# Altium schematic sheet Encoder_Sheet4.SchDoc
size 420 x 297 mm; SheetNumber: 31; SheetTotal: 32
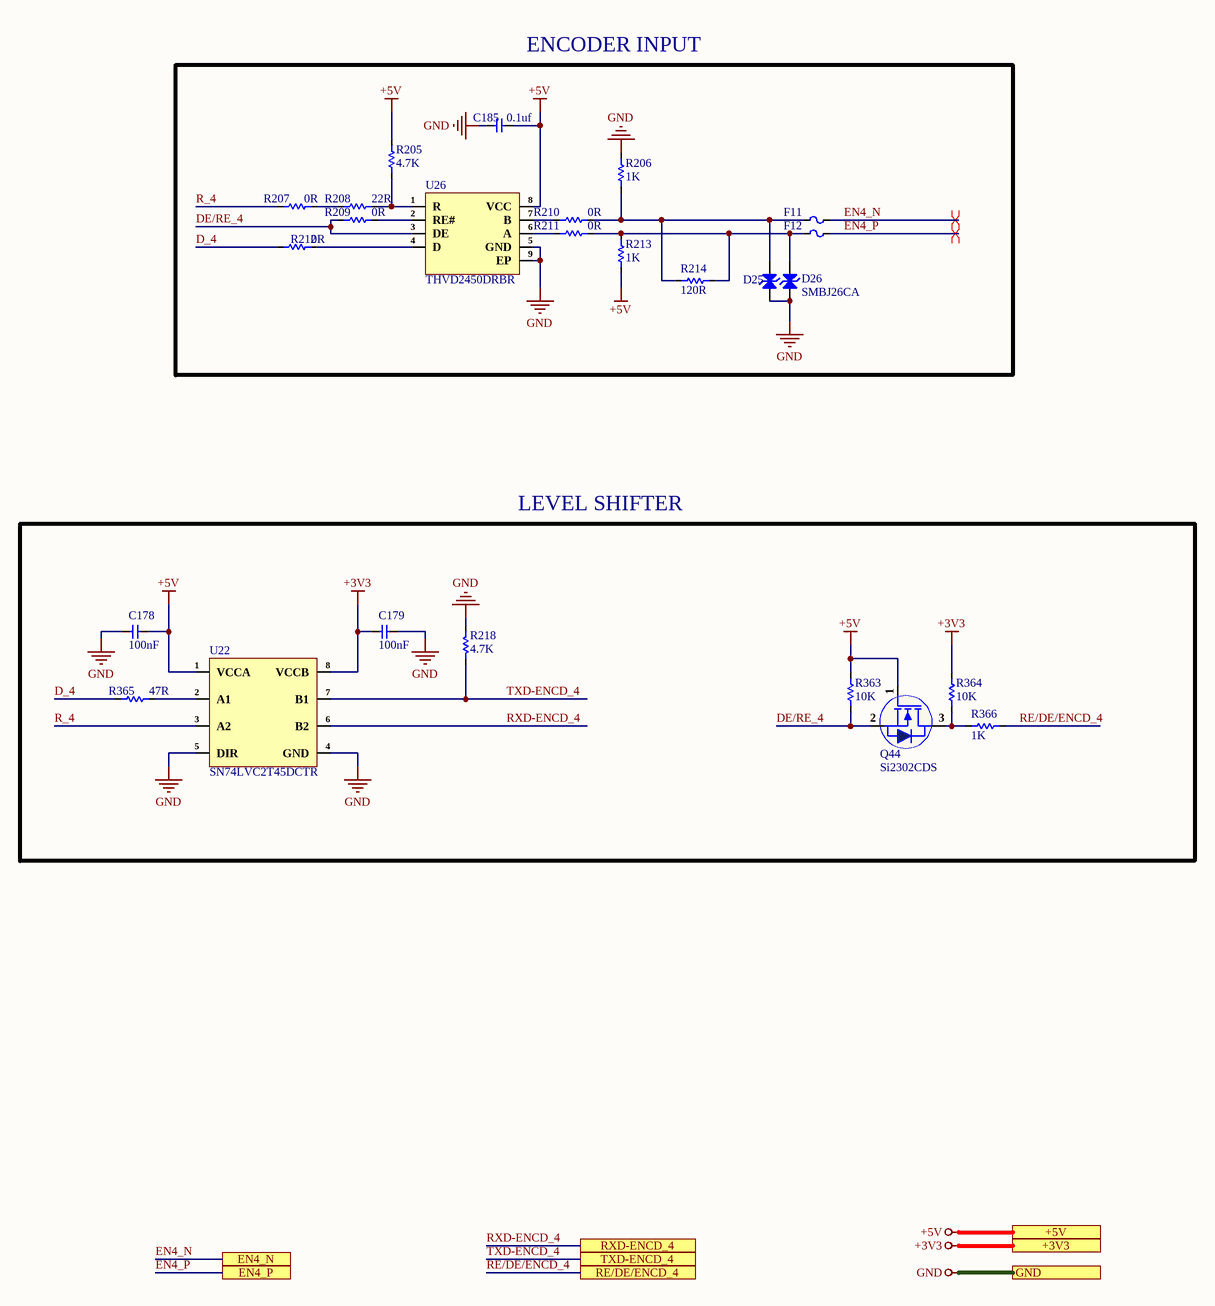
[diagram p0: Encoder_Sheet4.SchDoc]

## Parts
C178  100nF  [cap-0402]
C179  100nF  [cap-0402]
C185  0.1uf  [Cap-0402]
D25  SMBJ26CA  [SMB Bi Directional]  (value not drawn)
D26  SMBJ26CA  [SMB Bi Directional]
F11  SMD0805P020TF  [Fuse-0805]  (value not drawn)
F12  SMD0805P020TF  [Fuse-0805]  (value not drawn)
Q44  Si2302CDS  [Sot-23]
R205  4.7K  [Res-0402]
R206  1K  [Res-0402]
R207  0R  [Res-0603]
R208  22R  [Res-0402]
R209  0R  [Res-0603]
R210  0R  [Res-0603]
R211  0R  [Res-0603]
R212  0R  [Res-0603]
R213  1K  [Res-0402]
R214  120R  [Res-0402]
R218  4.7K  [Res-0402]
R363  10K  [Res-0402]
R364  10K  [Res-0402]
R365  47R  [Res-0402]
R366  1K  [Res-0603]
U22  SN74LVC2T45DCTR  [MSOP-8]
U26  THVD2450DRBR  [SON-8-EP(3x3)]

## Ports
+3V3 (see Servo4[3C], CAN_Sheet[5D], Connector_Sheet[5D], Controller_Sheet[5D], Encoder_Sheet1[5D], Encoder_Sheet2[5D], Encoder_Sheet3[5D], EtherCAT_Sheet[5D], Motor_Driver_Sheet1[5D], Motor_Driver_Sheet2[5D], Motor_Driver_Sheet3[5D], Motor_Driver_Sheet4[5D], Power_Sheet[5D], RJ45_Sheet[5D], RS485_RS232_Sheet[3D], Sec_Controller_Sheet1[5D], Sec_Controller_Sheet2[5D], Sec_Controller_Sheet3[5D], Sec_Controller_Sheet4[5D]), +5V (see Servo4[3C], CAN_Sheet[5D], DIO_1[5D], DIO_2[5D], DIO_3[5D], DIO_4[5D], Encoder_Sheet1[5D], Encoder_Sheet2[5D], Encoder_Sheet3[5D], Power_Sheet[5D], Sec_Controller_Sheet1[5D], Sec_Controller_Sheet2[5D], Sec_Controller_Sheet3[5D], Sec_Controller_Sheet4[5D]), EN4_N (see Servo4[3D], Connector_Sheet[3D], Servo4[2D]), EN4_P (see Servo4[3C], Connector_Sheet[3D], Servo4[2C]), GND (see Servo4[3C], CAN_Sheet[5D], Connector_Sheet[5D], Controller_Sheet[5D], DIO_1[5D], DIO_2[5D], DIO_3[5D], DIO_4[5D], Encoder_Sheet1[5D], Encoder_Sheet2[5D], Encoder_Sheet3[5D], EtherCAT_Sheet[5D], MOSFET_Driver_Sheet1[5D], MOSFET_Driver_Sheet2[5D], MOSFET_Driver_Sheet3[5D], MOSFET_Driver_Sheet4[5D], Motor_Driver_Sheet1[5D], Motor_Driver_Sheet2[5D], Motor_Driver_Sheet3[5D], Motor_Driver_Sheet4[5D], Power_Sheet[5D], RJ45_Sheet[5D], RS485_RS232_Sheet[3D], Sec_Controller_Sheet1[5D], Sec_Controller_Sheet2[5D], Sec_Controller_Sheet3[5D], Sec_Controller_Sheet4[5D]), RE/DE/ENCD_4 (see Servo4[3C], Sec_Controller_Sheet4[1D]), RXD-ENCD_4 (see Servo4[3C], Sec_Controller_Sheet4[1D]), TXD-ENCD_4 (see Servo4[3C], Sec_Controller_Sheet4[1D])

## Nets
+3V3: C179.1 R364.1 U22.8(VCCB) ; port +3V3
+5V: C178.1 C185.2 Q44.1(G) R205.2 R213.1 R363.1 U22.1(VCCA) U26.8(VCC) ; port +5V
GND: C178.2 C179.2 C185.1 D25.1(A) D26.1(A) R206.2 R218.2 U22.4(GND) U22.5(DIR) U26.5(GND) U26.9(EP) ; port GND
D_4: R212.1 R365.1
DE/RE_4: Q44.2(S) R209.1 R363.2 U26.3(DE)
EN4_N: F11.2 ; port EN4_N
EN4_P: F12.2 ; port EN4_P
R_4: R207.1 U22.3(A2)
RE/DE/ENCD_4: R366.2 ; port RE/DE/ENCD_4
RXD-ENCD_4: U22.6(B2) ; port RXD-ENCD_4
TXD-ENCD_4: R218.1 U22.7(B1) ; port TXD-ENCD_4
NetD25_2: D25.2(K) F11.1 R206.1 R210.2 R214.1
NetD26_2: D26.2(K) F12.1 R211.2 R213.2 R214.2
NetQ44_3: Q44.3(D) R364.2 R366.1
NetR205_1: R205.1 R208.2 U26.1(R)
NetR207_2: R207.2 R208.1
NetR209_2: R209.2 U26.2(RE#)
NetR210_1: R210.1 U26.7(B)
NetR211_1: R211.1 U26.6(A)
NetR212_2: R212.2 U26.4(D)
NetR365_2: R365.2 U22.2(A1)

## Layout directives
differential pair; net class RS485; differential pair class RS485_LINES; rule Impedance Constraint [Min = 115.0    Max = 120.0    ]; rule Matched Net Lengths [Tolerance = 0.508mm]: EN4_N, EN4_P

## Notes on the sheet
- ENCODER INPUT
- LEVEL SHIFTER
- File:
- Title:
- Date:
- Page
- Num:
- Total:
- Drawn By: Huzaifa Ali

## Library data of the parts
C178 C179 = C1005X7R1H104KT000F: CAP CER 0.1UF 50V X7R 0402; Manufacturer: TDK; Tolerance: 10%; Voltage: 25V; Item Type: Capacitor; Supplier 1: Avnet; Manufacturer Part Number: C1005X7R1H104KT000F; RoHS: No; Category: Ceramic Capacitors; Dielectric: X7R; Supplier Part Number 1: C1005X7R1H104KT000F; LCSC Part Number: C361198; ComponentLink1Description: LCSC; ComponentLink1URL: https://www.lcsc.com/product-detail/Multilayer-Ceramic-Capacitors-MLCC-SMD-SMT_TDK-C1005X7R1H104KT000F_C361198.html
C185 = GRM155R62A104KE14D: CAP CER 0.1UF 100V X5R 0402; Manufacturer: Murata; Capacitance: 100nF; Tolerance: 10%; Item Type: Capacitor; Supplier 1: Arrow Electronics; Manufacturer Part Number: GRM155R62A104KE14D; RoHS: Yes; Category: Ceramic Capacitors; Stock 1: 870000; Pricing 1: 10000=0.00500, 20000=0.00410, 30000=0.00390, 50000=0.00370, 100000=0.00300 (USD); Mount: Surface Mount; Case/Package: 0402; Case Code (Metric): 1005; Case Code (Imperial): 0402; Weight: 0.000212oz; Min Operating Temperature: -55°C; Max Operating Temperature: 85°C; Packaging: Tape and Reel; Voltage Rating: 100V; Dielectric: X5R; Termination: SMD/SMT; Voltage Rating (DC): 100V; Package Quantity: 10000; Series: GRM; Length: 0.039inch; Width: 0.02inch; Height: 0.5mm; Thickness: 0.022inch; Reach SVHC Compliant: Yes; Lead Free: Lead Free; RoHS Compliant: Yes; ComponentLink1URL: http://www.farnell.com/datasheets/2079151.pdf?src-supplier=Farnell; ComponentLink1Description: http://www.farnell.com/datasheets/2079151.pdf?src-supplier=Farnell; ComponentLink2URL: http://www.mouser.com/ds/2/281/c02e-2905.pdf?src-supplier=Mouser; ComponentLink2Description: http://www.mouser.com/ds/2/281/c02e-2905.pdf?src-supplier=Mouser; ComponentLink3URL: http://www.farnell.com/datasheets/2079151.pdf?src-supplier=Element14; ComponentLink3Description: http://www.farnell.com/datasheets/2079151.pdf?src-supplier=Element14; ComponentLink4URL: http://search.murata.co.jp/Ceramy/image/img/A01X/G101/ENG/GRM155R62A104KE14-01.pdf?src-supplier=Digi-Key; ComponentLink4Description: http://search.murata.co.jp/Ceramy/image/img/A01X/G101/ENG/GRM155R62A104KE14-01.pdf?src-supplier=Digi-Key; ComponentLink5URL: http://www.farnell.com/datasheets/2079151.pdf?src-supplier=Newark; ComponentLink5Description: http://www.farnell.com/datasheets/2079151.pdf?src-supplier=Newark; Supplier Part Number 1: GRM155R62A104KE14D; LCSC Part Number: C162178
D25 D26 = SMBJ26CA: SMB(DO-214AA) TVS ROHS; Manufacturer: MSKSEMI; Item Type: Diode; Manufacturer Part Number: SMBJ26CA; Package: SMB(DO-214AA); LCSC Part Number: C5331111; ComponentLink1Description: LCSC; ComponentLink1URL: https://www.lcsc.com/product-detail/TVS_MSKSEMI-SMBJ26CA_C5331111.html
F11 F12 = SMD0805P020TF: 9V 200mA 100A 500mA 0805 Resettable Fuses ROHS; Manufacturer: RUILON; Item Type: Fuse; Manufacturer Part Number: SMD0805P020TF; Package: 0805; LCSC Part Number: C20976; ComponentLink1Description: LCSC; ComponentLink1URL: https://www.lcsc.com/product-detail/Resettable-Fuses_RUILON-Shenzhen-Ruilongyuan-Elec-SMD0805P020TF_C20976.html
Q44 = Si2302CDS: N-CHANNEL 20-V (D-S) MOSFET; Manufacturer: TECH PUBLIC; ComponentLink1Description: LCSC; ComponentLink1URL: https://www.lcsc.com/product-detail/MOSFETs_TECH-PUBLIC-SI2302CDS_C5310968.html; Manufacturer Part Number: SI2302CDS; Package: SOT-23; LCSC Part Number: C5310968; Item Type: Mosfet
R205 R218 = RC0402FR-074K7L: RES 4.7K OHM 1% 1/16W 0402; Manufacturer: Yageo; Voltage Rating (DC): 50V; Power Rating: 62.5mW; Resistance: 4.7kR; Temperature Coefficient: 100ppm/°C; Max Power Dissipation: 63mW; Item Type: Resistor; Supplier 1: Avnet; Manufacturer Part Number: RC0402FR-074K7L; RoHS: Yes; Category: Chip SMD Resistors; Stock 1: 2420000; Pricing 1: 10000=0.00085 (USD); Case/Package: 0402; Number of Pins: 2; Case Code (Imperial): 0402; Case Code (Metric): 1005; Size Code: 0402; Min Operating Temperature: -55°C; Max Operating Temperature: 155°C; Tolerance: 1%; Voltage Rating: 50V; Packaging: Tape and Reel; Resistor Type: Thick Film; Termination: SMD/SMT; Features: Moisture Resistant; Series: RC; Number of Terminations: 2; Resistance Tolerance: 1%; Construction: Rectangular; Length: 1mm; Width: 0.5mm; Height: 0.32mm; Depth: 0.5mm; Height - Seated (Max): 0.016inch; RoHS Compliant: Yes; Reach SVHC Compliant: Yes; Military Standard: Not; Lead Free: Lead Free; ComponentLink1URL: https://datasheet.ciiva.com/22661/1686128-22661342.pdf?src-supplier=Element14; ComponentLink1Description: https://datasheet.ciiva.com/22661/1686128-22661342.pdf?src-supplier=Element14; ComponentLink2URL: https://datasheet.ciiva.com/7850/1018594-7850022.pdf?src-supplier=Element14; ComponentLink2Description: https://datasheet.ciiva.com/7850/1018594-7850022.pdf?src-supplier=Element14; ComponentLink3URL: https://datasheet.ciiva.com/7850/1018594-7850023.pdf?src-supplier=Element14; ComponentLink3Description: https://datasheet.ciiva.com/7850/1018594-7850023.pdf?src-supplier=Element14; ComponentLink4URL: https://datasheet.ciiva.com/15215/getdatasheetpartid-328119-15215035.pdf?src-supplier=Verical; ComponentLink4Description: https://datasheet.ciiva.com/15215/getdatasheetpartid-328119-15215035.pdf?src-supplier=Verical; Supplier Part Number 1: RC0402FR-074K7L; LCSC Part Number: C105871
R206 R213 = RC0402FR-071KL: RES 1K OHM 1% 1/16W 0402; Manufacturer: Yageo; Resistance: 1kR; Temperature Coefficient: 100ppm/°C; Voltage Rating (DC): 50V; Power Rating: 62.5mW; Max Power Dissipation: 63mW; Item Type: Resistor; Supplier 1: Avnet; Manufacturer Part Number: RC0402FR-071KL; RoHS: Yes; Category: Chip SMD Resistors; Stock 1: 13030000; Pricing 1: 10000=0.00085, 20000=0.00087, 40000=0.00084, 60000=0.00083, 80000=0.00079, 100000=0.00078, 1000000=0.00076 (USD); Case/Package: 0402; Number of Pins: 2; Case Code (Imperial): 0402; Case Code (Metric): 1005; Size Code: 0402; Min Operating Temperature: -55°C; Max Operating Temperature: 155°C; Resistor Type: Thick Film; Tolerance: 1%; Packaging: Tape and Reel; Voltage Rating: 50V; Termination: SMD/SMT; Features: Moisture Resistant; Series: RC; Number of Terminations: 2; Resistance Tolerance: 1%; Construction: Rectangular; Technology: THICK FILM; Length: 1mm; Width: 0.5mm; Height: 0.32mm; Depth: 0.5mm; Reach SVHC Compliant: Yes; Lead Free: Lead Free; RoHS Compliant: Yes; Military Standard: Not; ComponentLink1URL: https://datasheet.ciiva.com/11819/0900766b80c66297-11819477.pdf?src-supplier=RSComponents; ComponentLink1Description: https://datasheet.ciiva.com/11819/0900766b80c66297-11819477.pdf?src-supplier=RSComponents; ComponentLink2URL: https://datasheet.ciiva.com/7983/1018594-7983502.pdf?src-supplier=Element14; ComponentLink2Description: https://datasheet.ciiva.com/7983/1018594-7983502.pdf?src-supplier=Element14; ComponentLink3URL: https://datasheet.ciiva.com/22747/1018594-22747513.pdf?src-supplier=Element14; ComponentLink3Description: https://datasheet.ciiva.com/22747/1018594-22747513.pdf?src-supplier=Element14; ComponentLink4URL: https://datasheet.ciiva.com/12666/pyu-rc0402-51-rohs-l-6-r-12666741.pdf?src-supplier=Mouser; ComponentLink4Description: https://datasheet.ciiva.com/12666/pyu-rc0402-51-rohs-l-6-r-12666741.pdf?src-supplier=Mouser; ComponentLink5URL: https://datasheet.ciiva.com/7849/1018594-7849869.pdf?src-supplier=Element14; ComponentLink5Description: https://datasheet.ciiva.com/7849/1018594-7849869.pdf?src-supplier=Element14; ComponentLink6URL: https://datasheet.ciiva.com/7849/1018594-7849871.pdf?src-supplier=Element14; ComponentLink6Description: https://datasheet.ciiva.com/7849/1018594-7849871.pdf?src-supplier=Element14; ComponentLink7URL: https://datasheet.ciiva.com/17063/pyu-rc0402-51-rohs-l-6-r-17063193.pdf?src-supplier=Future+Electronics; ComponentLink7Description: https://datasheet.ciiva.com/17063/pyu-rc0402-51-rohs-l-6-r-17063193.pdf?src-supplier=Future+Electronics; Supplier Part Number 1: RC0402FR-071KL; LCSC Part Number: C106235
R207 R209-R212 = RC0603JR-070RL: RES 0 OHM JUMPER 1/10W 0603; Manufacturer: Yageo; Resistance: 0mR; Tolerance: 1%; Power Rating: 100mW; Voltage Rating (DC): 50V; Temperature Coefficient: 200ppm/°C; Resistance Tolerance: 5%; Item Type: Resistor; Supplier 1: Digi-Key; Manufacturer Part Number: RC0603JR-070RL; RoHS: Yes; Category: Chip SMD Resistors; Stock 1: 18081776; Pricing 1: 1=0.10000, 10=0.01700, 25=0.01240, 50=0.00960, 100=0.00700, 250=0.00536, 500=0.00430, 1000=0.00316 (USD); Case/Package: 0603; Number of Pins: 2; Contact Plating: Tin,Matte; Case Code (Imperial): 0603; Case Code (Metric): 1608; Size Code: 0603; Min Operating Temperature: -55°C; Max Operating Temperature: 155°C; Resistor Type: Thick Film; Packaging: Tape and Reel; Termination: SMD/SMT; Series: RC; Technology: THICK FILM; Package Quantity: 5000; Voltage Rating: 50V; Features: Moisture Resistant; Max Power Dissipation: 100mW; Number of Terminations: 2; Construction: Rectangular; Length: 1.6mm; Width: 0.8mm; Height: 0.45mm; Depth: 0.8mm; Radiation Hardening: No; Reach SVHC Compliant: No SVHC; Lead Free: Lead Free; RoHS Compliant: Yes; Military Standard: Not; Supplier Part Number 1: 311-0.0GRCT-ND; LCSC Part Number: C95177
R208 = RC0402FR-0722RL: RES 22 OHM 1% 1/16W 0402; Manufacturer: Yageo; Voltage Rating: 50V; Power Rating: 62.5mW; Temperature Coefficient: 100ppm/°C; Max Power Dissipation: 63mW; Item Type: Resistor; Supplier 1: Avnet; Manufacturer Part Number: RC0402FR-0722RL; RoHS: Yes; Category: Chip SMD Resistors; Stock 1: 1810000; Pricing 1: 10000=0.00085 (USD); Case/Package: 0402; Number of Pins: 2; Case Code (Imperial): 0402; Case Code (Metric): 1005; Size Code: 0402; Min Operating Temperature: -55°C; Max Operating Temperature: 155°C; Resistor Type: Thick Film; Voltage Rating (DC): 50V; Resistance: 22R; Tolerance: 1%; Packaging: Tape and Reel; Termination: SMD/SMT; Features: Moisture Resistant; Series: RC; Number of Terminations: 2; Resistance Tolerance: 1%; Technology: THICK FILM; Construction: Rectangular; Length: 1mm; Width: 0.5mm; Height: 0.32mm; Depth: 0.5mm; RoHS Compliant: Yes; Reach SVHC Compliant: Yes; Military Standard: Not; Lead Free: Lead Free; ComponentLink1URL: https://datasheet.ciiva.com/11819/0900766b80c66297-11819462.pdf?src-supplier=RSComponents; ComponentLink1Description: https://datasheet.ciiva.com/11819/0900766b80c66297-11819462.pdf?src-supplier=RSComponents; ComponentLink2URL: https://datasheet.ciiva.com/7849/1018594-7849912.pdf?src-supplier=Element14; ComponentLink2Description: https://datasheet.ciiva.com/7849/1018594-7849912.pdf?src-supplier=Element14; ComponentLink3URL: https://datasheet.ciiva.com/7849/1018594-7849911.pdf?src-supplier=Element14; ComponentLink3Description: https://datasheet.ciiva.com/7849/1018594-7849911.pdf?src-supplier=Element14; ComponentLink4URL: https://datasheet.ciiva.com/16930/pyu-rc0402-51-rohs-l-6-r-16930687.pdf?src-supplier=Future+Electronics; ComponentLink4Description: https://datasheet.ciiva.com/16930/pyu-rc0402-51-rohs-l-6-r-16930687.pdf?src-supplier=Future+Electronics; ComponentLink5URL: https://datasheet.ciiva.com/26829/getdatasheetpartid-554995-26829991.pdf?src-supplier=Verical; ComponentLink5Description: https://datasheet.ciiva.com/26829/getdatasheetpartid-554995-26829991.pdf?src-supplier=Verical; Supplier Part Number 1: RC0402FR-0722RL; LCSC Part Number: C114765
R214 = RC0402FR-07120RL: RES 120 OHM 1% 1/16W 0402; Manufacturer: Yageo; Item Type: Resistors; Power Rating: 62.5mW; Voltage Rating: 50V; Temperature Coefficient: 100ppm/°C; Max Power Dissipation: 63mW; Supplier: Future Electronics; Supplier Part Number: 4529079; Manufacturer Part Number: RC0402FR-07120RL; RoHS: Yes; Stock: 150000; Pricing: 10000=0.0012, 100000=0.0011, 300000=0.001, 750000=0.001, 2000000=0.0009 (USD); Case/Package: 0402; Case Code (Imperial): 0402; Case Code (Metric): 1005; Min Operating Temperature: -55°C; Max Operating Temperature: 155°C; Package Quantity: 1; Value: 120R; Tolerance: 1%; Packaging: Tape and Reel; Termination: SMD/SMT; Resistor Type: Thick Film; Number of Terminations: 2; Features: Moisture Resistant; Series: RC; Resistance Tolerance: 1%; Construction: Rectangular; Technology: THICK FILM; Voltage Rating (AC): 50V; Length: 0.039inch; Width: 0.02inch; Height: 0.016inch; Depth: 0.5mm; Reach SVHC Compliant: No; Military Standard: Not; RoHS Compliant: Yes; Lead Free: 5697LeadFree; ComponentLink1URL: https://datasheet.ciiva.com/12667/pyu-rc0402-51-rohs-l-6-r-12667958.pdf?src-supplier=Mouser; ComponentLink1Description: https://datasheet.ciiva.com/12667/pyu-rc0402-51-rohs-l-6-r-12667958.pdf?src-supplier=Mouser; ComponentLink2URL: https://datasheet.ciiva.com/7849/1018594-7849831.pdf?src-supplier=Element14; ComponentLink2Description: https://datasheet.ciiva.com/7849/1018594-7849831.pdf?src-supplier=Element14; LCSC Part Number: C114758
R363 R364 = RC0402FR-0710KL: RES 10K OHM 1% 1/16W 0402; Manufacturer: Yageo; Resistance: 10kR; Voltage Rating (DC): 50V; Temperature Coefficient: 100ppm/°C; Power Rating: 62.5mW; Max Power Dissipation: 63mW; Item Type: Resistor; Supplier 1: Mouser; Manufacturer Part Number: RC0402FR-0710KL; RoHS: Yes; Category: Chip SMD Resistors; Stock 1: 18648329; Pricing 1: 1=0.10000, 10=0.01400, 50=0.01400, 100=0.00500, 1000=0.00300, 10000=0.00200 (USD); Case/Package: 0402; Number of Pins: 2; Case Code (Imperial): 0402; Case Code (Metric): 1005; Min Operating Temperature: -55°C; Max Operating Temperature: 155°C; Resistor Type: Thick Film; Tolerance: 1%; Packaging: Tape and Reel; Voltage Rating: 50V; Termination: SMD/SMT; Working Voltage: 50V; Number of Terminations: 2; Features: Moisture Resistant; Series: RC; Resistance Tolerance: 1%; Construction: Rectangular; Length: 1mm; Width: 0.5mm; Height: 0.32mm; Depth: 0.5mm; Lead Pitch: 0.2mm; REACH SVHC: No SVHC; Lead Free: Lead Free; RoHS Compliant: Yes; Military Standard: Not; ComponentLink1URL: https://datasheet.ciiva.com/7660/38568-7660787.pdf?src-supplier=Element14; ComponentLink1Description: https://datasheet.ciiva.com/7660/38568-7660787.pdf?src-supplier=Element14; ComponentLink2URL: https://datasheet.ciiva.com/7849/1686128-7849814.pdf?src-supplier=Element14; ComponentLink2Description: https://datasheet.ciiva.com/7849/1686128-7849814.pdf?src-supplier=Element14; ComponentLink3URL: https://datasheet.ciiva.com/7983/1018594-7983486.pdf?src-supplier=Element14; ComponentLink3Description: https://datasheet.ciiva.com/7983/1018594-7983486.pdf?src-supplier=Element14; ComponentLink4URL: https://datasheet.ciiva.com/22747/1018594-22747512.pdf?src-supplier=Element14; ComponentLink4Description: https://datasheet.ciiva.com/22747/1018594-22747512.pdf?src-supplier=Element14; ComponentLink5URL: https://datasheet.ciiva.com/12667/pyu-rc0402-51-rohs-l-6-r-12667067.pdf?src-supplier=Mouser; ComponentLink5Description: https://datasheet.ciiva.com/12667/pyu-rc0402-51-rohs-l-6-r-12667067.pdf?src-supplier=Mouser; ComponentLink6URL: https://datasheet.ciiva.com/7849/1784430-7849813.pdf?src-supplier=Element14; ComponentLink6Description: https://datasheet.ciiva.com/7849/1784430-7849813.pdf?src-supplier=Element14; ComponentLink7URL: https://datasheet.ciiva.com/7849/1784430-7849815.pdf?src-supplier=Element14; ComponentLink7Description: https://datasheet.ciiva.com/7849/1784430-7849815.pdf?src-supplier=Element14; Supplier Part Number 1: 603-RC0402FR-0710KL; LCSC Part Number: C60490
R365 = RC0402FR-0747RL: RES 47 OHM 1% 1/16W 0402; Manufacturer: Yageo; Temperature Coefficient: 100ppm/°C; Power Rating: 63mW; Voltage Rating: 50V; Item Type: Resistor; Supplier 1: Avnet; Manufacturer Part Number: RC0402FR-0747RL; RoHS: Yes; Category: Chip SMD Resistors; Stock 1: 390000; Pricing 1: 10000=0.00085 (USD); Case/Package: 0402; Case Code (Metric): 1005; Case Code (Imperial): 0402; Weight: 2.3E-05oz; Size Code: 0402; Min Operating Temperature: -55°C; Max Operating Temperature: 155°C; Resistance: 47R; Tolerance: 1%; Packaging: Tape and Reel; Resistor Type: Thick Film; Package Quantity: 1; Number of Terminations: 2; Termination: SMD/SMT; Max Power Dissipation: 63mW; Features: Moisture Resistant; Series: RC; Construction: Rectangular; Technology: THICK FILM; Resistance Tolerance: 1%; Length: 1mm; Width: 0.02inch; Height: 0.016inch; Depth: 0.5mm; Lead Free: Lead Free; Military Standard: Not; RoHS Compliant: Yes; Supplier Part Number 1: RC0402FR-0747RL; LCSC Part Number: C137973; ComponentLink1Description: LCSC; ComponentLink1URL: https://www.lcsc.com/product-detail/Chip-span-style-background-color-ff0-Resistor-span-Surface-Mount_YAGEO-RC0402FR-0747RL_C137973.html
R366 = RC0603FR-071KL: RES SMD 1K OHM 1% 1/10W 0603; Manufacturer: Yageo; Resistance: 1kR; Temperature Coefficient: 100ppm/°C; Power Rating: 100mW; Voltage Rating: 50V; Item type: Resistor; ComponentLink1URL: https://www.verical.com/server-webapp/html/getDatasheet?partID=409289&src-supplier=Verical; ComponentLink1Description: https://www.verical.com/server-webapp/html/getDatasheet?partID=409289&src-supplier=Verical; Supplier 1: Digi-Key; Manufacturer Part Number: RC0603FR-071KL; Stock 1: 21472395; Pricing 1: 1=0.1, 10=0.023, 100=0.0094, 1000=0.0042, 2500=0.0037 (USD); Case/Package: 0603; Contact Plating: Tin,Matte; Case Code (Imperial): 0603; Case Code (Metric): 1608; Min Operating Temperature: -55°C; Max Operating Temperature: 155°C; Tolerance: 1%; Composition: Thick Film; Packaging: Tape and Reel; Termination: SMD/SMT; Military Standard: Not; Length: 1.6mm; Height: 0.45mm; Depth: 0.8mm; Radiation Hardening: No; REACH SVHC: No SVHC; Lead Free: Lead Free; ComponentLink2URL: http://documents.rs-components.com/techlib://itc_doclist_GB.htm?stockno=5048928&src-supplier=RSComponents; ComponentLink2Description: http://documents.rs-components.com/techlib://itc_doclist_GB.htm?stockno=5048928&src-supplier=RSComponents; ComponentLink3URL: http://www.yageo.com/documents/recent/PYu-RC0603_51_RoHS_L_4.pdf?src-supplier=Avnet+Europe; ComponentLink3Description: http://www.yageo.com/documents/recent/PYu-RC0603_51_RoHS_L_4.pdf?src-supplier=Avnet+Europe; ComponentLink4URL: http://www.farnell.com/datasheets/2167052.pdf?src-supplier=Element14; ComponentLink4Description: http://www.farnell.com/datasheets/2167052.pdf?src-supplier=Element14; ComponentLink5URL: http://www.farnell.com/datasheets/1868787.pdf?src-supplier=Element14; ComponentLink5Description: http://www.farnell.com/datasheets/1868787.pdf?src-supplier=Element14; ComponentLink6URL: http://www.yageo.com/documents/recent/PYu-RC_Group_51_RoHS_L_2.pdf?src-supplier=Avnet; ComponentLink6Description: http://www.yageo.com/documents/recent/PYu-RC_Group_51_RoHS_L_2.pdf?src-supplier=Avnet; ComponentLink7URL: https://www.verical.com/server-webapp/html/getDatasheet?partID=404327&src-supplier=Verical; ComponentLink7Description: https://www.verical.com/server-webapp/html/getDatasheet?partID=404327&src-supplier=Verical; ComponentLink8URL: http://www.farnell.com/datasheets/443971.pdf?src-supplier=Element14; ComponentLink8Description: http://www.farnell.com/datasheets/443971.pdf?src-supplier=Element14; Supplier Part Number 1: 311-1.00KHRDKR-ND; LCSC Part Number: C22548
U22 = SN74LVC2T45DCTR: IC TRANSLATOR BIDIRECTIONAL SM8; Manufacturer: Texas Instruments; Supplier: Mouser; LCSC Part Number: C22672; Manufacturer Part Number: SN74LVC2T45DCTR; RoHS: Yes; Item Type: IC; Stock: 182025; Pricing: 1=0.83, 10=0.709, 50=0.709, 100=0.567, 1000=0.413, 10000=0.334 (USD); ComponentLink1URL: https://datasheet.ciiva.com/15086/getdatasheetpartid-190128-15086325.pdf?src-supplier=Verical; ComponentLink1Description: https://datasheet.ciiva.com/15086/getdatasheetpartid-190128-15086325.pdf?src-supplier=Verical; ComponentLink2URL: https://datasheet.ciiva.com/1899/sn74lvc2t45-1899281.pdf?src-supplier=Digikey; ComponentLink2Description: https://datasheet.ciiva.com/1899/sn74lvc2t45-1899281.pdf?src-supplier=Digikey; ComponentLink3URL: https://datasheet.ciiva.com/34301/1046748-34301921.pdf?src-supplier=Jameco; ComponentLink3Description: https://datasheet.ciiva.com/34301/1046748-34301921.pdf?src-supplier=Jameco; ComponentLink4URL: https://datasheet.ciiva.com/1628/1862500-1628670.pdf?src-supplier=Newark; ComponentLink4Description: https://datasheet.ciiva.com/1628/1862500-1628670.pdf?src-supplier=Newark; ComponentLink5URL: https://datasheet.ciiva.com/46395/1882347-46395882.pdf?src-supplier=Element14; ComponentLink5Description: https://datasheet.ciiva.com/46395/1882347-46395882.pdf?src-supplier=Element14; ComponentLink6URL: https://datasheet.ciiva.com/22653/sn74lvc2t45-22653414.pdf?src-supplier=Farnell; ComponentLink6Description: https://datasheet.ciiva.com/22653/sn74lvc2t45-22653414.pdf?src-supplier=Farnell; ComponentLink7URL: https://datasheet.ciiva.com/14300/sn74lvc2t45-14300710.pdf?src-supplier=Avnet; ComponentLink7Description: https://datasheet.ciiva.com/14300/sn74lvc2t45-14300710.pdf?src-supplier=Avnet; ComponentLink8URL: https://datasheet.ciiva.com/14300/sn74lvc2t45-14300711.pdf?src-supplier=Avnet; ComponentLink8Description: https://datasheet.ciiva.com/14300/sn74lvc2t45-14300711.pdf?src-supplier=Avnet; ComponentLink9URL: https://datasheet.ciiva.com/1899/sn74lvc2t45-1899282.pdf?src-supplier=Digikey; ComponentLink9Description: https://datasheet.ciiva.com/1899/sn74lvc2t45-1899282.pdf?src-supplier=Digikey; ComponentLink10URL: https://datasheet.ciiva.com/1899/sn74lvc2t45-1899283.pdf?src-supplier=Digikey; ComponentLink10Description: https://datasheet.ciiva.com/1899/sn74lvc2t45-1899283.pdf?src-supplier=Digikey; ComponentLink11URL: https://datasheet.ciiva.com/1508/1863620-1508814.pdf?src-supplier=Element14; ComponentLink11Description: https://datasheet.ciiva.com/1508/1863620-1508814.pdf?src-supplier=Element14
U26 = THVD2450DRBR: IC TRANSCEIVER HALF 1/1 8SON; Manufacturer: Texas Instruments; Supplier: Digikey; Supplier Part Number: 296-THVD2450DRBRCT-ND; Manufacturer Part Number: THVD2450DRBR; RoHS: Yes; Item Type: IC; Stock: 2652; Pricing: 1=4.05, 10=3.639, 25=3.4404, 100=2.9818, 250=2.82892, 500=2.53838, 1000=2.1408 (USD); Pins: 8NUMBER; Length: 3mm; Width: 3mm; Height: 1mm; Thickness: 880um; LCSC Part Number: C2878080